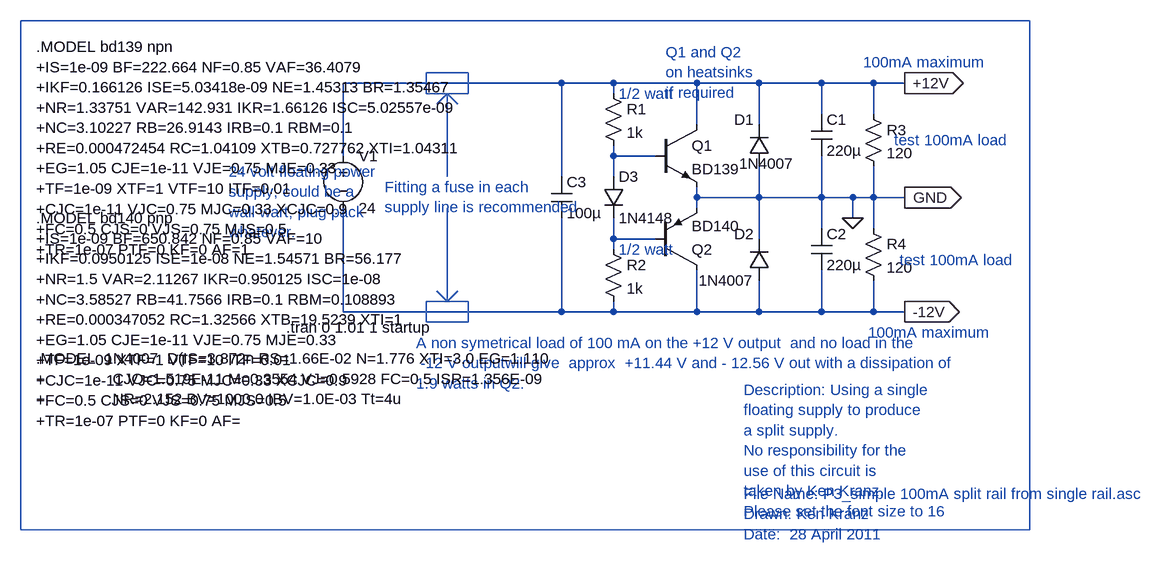
[diagram p0: schematic P3_simple100mAsplitrailfromsinglerail.asc]
P3_simple100mAsplitrailfromsinglerail.asc, the LTspice schematic file:
Version 4
SHEET 1 1304 932
WIRE 80 128 -256 128
WIRE 160 128 80 128
WIRE 288 128 160 128
WIRE 384 128 288 128
WIRE 480 128 384 128
WIRE 560 128 480 128
WIRE 608 128 560 128
WIRE 160 144 160 128
WIRE 480 176 480 128
WIRE 560 176 560 128
WIRE 288 192 288 128
WIRE 384 192 384 128
WIRE -256 240 -256 128
WIRE 160 240 160 224
WIRE 224 240 160 240
WIRE 80 272 80 128
WIRE 160 272 160 240
WIRE 288 304 288 288
WIRE 384 304 384 256
WIRE 384 304 288 304
WIRE 480 304 480 240
WIRE 480 304 384 304
WIRE 528 304 480 304
WIRE 560 304 560 256
WIRE 560 304 528 304
WIRE 608 304 560 304
WIRE 288 320 288 304
WIRE 528 336 528 304
WIRE 480 352 480 304
WIRE 560 352 560 304
WIRE 160 368 160 336
WIRE 224 368 160 368
WIRE 384 368 384 304
WIRE 160 384 160 368
WIRE -256 480 -256 320
WIRE 80 480 80 336
WIRE 80 480 -256 480
WIRE 160 480 160 464
WIRE 160 480 80 480
WIRE 288 480 288 416
WIRE 288 480 160 480
WIRE 384 480 384 432
WIRE 384 480 288 480
WIRE 480 480 480 416
WIRE 480 480 384 480
WIRE 560 480 560 432
WIRE 560 480 480 480
WIRE 608 480 560 480
FLAG 528 336 0
FLAG 608 304 GND
IOPIN 608 304 Out
FLAG 608 128 +12V
IOPIN 608 128 Out
FLAG 608 480 -12V
IOPIN 608 480 Out
SYMBOL voltage -256 224 R0
WINDOW 123 0 0 Left 2
WINDOW 39 0 0 Left 2
SYMATTR InstName V1
SYMATTR Value 24
SYMBOL res 144 128 R0
SYMATTR InstName R1
SYMATTR Value 1k
SYMBOL res 144 368 R0
SYMATTR InstName R2
SYMATTR Value 1k
SYMBOL cap 464 176 R0
SYMATTR InstName C1
SYMATTR Value 220µ
SYMBOL cap 464 352 R0
SYMATTR InstName C2
SYMATTR Value 220µ
SYMBOL cap 64 272 R0
SYMATTR InstName C3
SYMATTR Value 100µ
SYMBOL diode 400 256 R180
WINDOW 0 24 72 Left 2
WINDOW 3 -38 4 Left 2
SYMATTR InstName D1
SYMATTR Value 1N4007
SYMBOL diode 400 432 R180
WINDOW 0 24 72 Left 2
WINDOW 3 24 0 Left 2
SYMATTR InstName D2
SYMATTR Value 1N4007
SYMBOL diode 144 272 R0
SYMATTR InstName D3
SYMATTR Value 1N4148
SYMBOL res 544 160 R0
SYMATTR InstName R3
SYMATTR Value 120
SYMATTR SpiceLine pwr=2
SYMBOL res 544 336 R0
SYMATTR InstName R4
SYMATTR Value 120
SYMATTR SpiceLine pwr=2
SYMBOL npn 224 192 R0
SYMATTR InstName Q1
SYMATTR Value BD139
SYMATTR Prefix Q
SYMBOL pnp 224 416 M180
SYMATTR InstName Q2
SYMATTR Value BD140
TEXT -432 264 Left 2 ;24 volt floating power\nsupply, could be a \nwall wart, plug pack\nwhatever.
TEXT 544 96 Left 2 ;100mA maximum
TEXT 552 512 Left 2 ;100mA maximum
TEXT -192 288 Left 2 ;Fitting a fuse in each \nsupply line is recommended
TEXT -344 504 Left 2 !.tran 0 1.01 1 startup
TEXT 168 144 Left 2 ;1/2 watt
TEXT 168 384 Left 2 ;1/2 watt
TEXT 592 216 Left 2 ;test 100mA load
TEXT 600 400 Left 2 ;test 100mA load
TEXT 240 80 Left 2 ;Q1 and Q2\non heatsinks\nif required
TEXT -144 528 Left 2 ;A non symetrical load of 100 mA on the +12 V output  and no load in the\n -12 V outputwill give  approx  +11.44 V and - 12.56 V out with a dissipation of\n1.9 watts in Q2.
TEXT -728 72 Left 2 !.MODEL bd139 npn\n+IS=1e-09 BF=222.664 NF=0.85 VAF=36.4079\n+IKF=0.166126 ISE=5.03418e-09 NE=1.45313 BR=1.35467\n+NR=1.33751 VAR=142.931 IKR=1.66126 ISC=5.02557e-09\n+NC=3.10227 RB=26.9143 IRB=0.1 RBM=0.1\n+RE=0.000472454 RC=1.04109 XTB=0.727762 XTI=1.04311\n+EG=1.05 CJE=1e-11 VJE=0.75 MJE=0.33\n+TF=1e-09 XTF=1 VTF=10 ITF=0.01\n+CJC=1e-11 VJC=0.75 MJC=0.33 XCJC=0.9\n+FC=0.5 CJS=0 VJS=0.75 MJS=0.5\n+TR=1e-07 PTF=0 KF=0 AF=1
TEXT -728 336 Left 2 !.MODEL bd140 pnp\n+IS=1e-09 BF=650.842 NF=0.85 VAF=10\n+IKF=0.0950125 ISE=1e-08 NE=1.54571 BR=56.177\n+NR=1.5 VAR=2.11267 IKR=0.950125 ISC=1e-08\n+NC=3.58527 RB=41.7566 IRB=0.1 RBM=0.108893\n+RE=0.000347052 RC=1.32566 XTB=19.5239 XTI=1\n+EG=1.05 CJE=1e-11 VJE=0.75 MJE=0.33\n+TF=1e-09 XTF=1 VTF=10 ITF=0.01\n+CJC=1e-11 VJC=0.75 MJC=0.33 XCJC=0.9\n+FC=0.5 CJS=0 VJS=0.75 MJS=0.5\n+TR=1e-07 PTF=0 KF=0 AF=
TEXT -728 552 Left 2 !.MODEL  1N4007  D(IS=3.872n RS=1.66E-02 N=1.776 XTI=3.0 EG=1.110 \n+               CJO=1.519E-11 M=0.3554 VJ=0.5928 FC=0.5 ISR=1.356E-09\n+               NR=2.152 BV=1000.0 IBV=1.0E-03 Tt=4u
TEXT 360 600 Left 2 ;Description: Using a single\nfloating supply to produce\na split supply.\nNo responsibility for the\nuse of this circuit is \ntaken by Ken Kranz.\nPlease set the font size to 16
TEXT 360 760 Left 2 ;File Name: P3_simple 100mA split rail from single rail.asc\nDrawn: Ken Kranz\nDate:  28 April 2011
LINE Normal -96 144 -96 272
LINE Normal -96 144 -96 144
LINE Normal -80 160 -96 144
LINE Normal -96 144 -112 160
LINE Normal -96 464 -96 320
LINE Normal -80 448 -96 464
LINE Normal -112 448 -96 464
RECTANGLE Normal -64 144 -128 112
RECTANGLE Normal -64 496 -128 464
RECTANGLE Normal 800 816 -752 32

The netlist it stands for:
* P3_simple100mAsplitrailfromsinglerail.asc
V1 +12V -12V 24
R1 +12V N001 1k
R2 N002 -12V 1k
C1 +12V 0 220µ
C2 0 -12V 220µ
C3 +12V -12V 100µ
D1 0 +12V 1N4007
D2 -12V 0 1N4007
D3 N001 N002 1N4148
R3 +12V 0 120 pwr=2
R4 0 -12V 120 pwr=2
Q1 +12V N001 0 0 BD139
Q2 -12V N002 0 0 BD140
.model D D
.lib standard.dio
.model NPN NPN
.model PNP PNP
.lib standard.bjt
* 24 volt floating power
* supply, could be a
* wall wart, plug pack
* whatever.
* 100mA maximum
* 100mA maximum
* Fitting a fuse in each
* supply line is recommended
.tran 0 1.01 1 startup
* 1/2 watt
* 1/2 watt
* test 100mA load
* test 100mA load
* Q1 and Q2
* on heatsinks
* if required
* A non symetrical load of 100 mA on the +12 V output  and no load in the
*  -12 V outputwill give  approx  +11.44 V and - 12.56 V out with a dissipation of
* 1.9 watts in Q2.
.MODEL bd139 npn
+IS=1e-09 BF=222.664 NF=0.85 VAF=36.4079
+IKF=0.166126 ISE=5.03418e-09 NE=1.45313 BR=1.35467
+NR=1.33751 VAR=142.931 IKR=1.66126 ISC=5.02557e-09
+NC=3.10227 RB=26.9143 IRB=0.1 RBM=0.1
+RE=0.000472454 RC=1.04109 XTB=0.727762 XTI=1.04311
+EG=1.05 CJE=1e-11 VJE=0.75 MJE=0.33
+TF=1e-09 XTF=1 VTF=10 ITF=0.01
+CJC=1e-11 VJC=0.75 MJC=0.33 XCJC=0.9
+FC=0.5 CJS=0 VJS=0.75 MJS=0.5
+TR=1e-07 PTF=0 KF=0 AF=1
.MODEL bd140 pnp
+IS=1e-09 BF=650.842 NF=0.85 VAF=10
+IKF=0.0950125 ISE=1e-08 NE=1.54571 BR=56.177
+NR=1.5 VAR=2.11267 IKR=0.950125 ISC=1e-08
+NC=3.58527 RB=41.7566 IRB=0.1 RBM=0.108893
+RE=0.000347052 RC=1.32566 XTB=19.5239 XTI=1
+EG=1.05 CJE=1e-11 VJE=0.75 MJE=0.33
+TF=1e-09 XTF=1 VTF=10 ITF=0.01
+CJC=1e-11 VJC=0.75 MJC=0.33 XCJC=0.9
+FC=0.5 CJS=0 VJS=0.75 MJS=0.5
+TR=1e-07 PTF=0 KF=0 AF=
.MODEL  1N4007  D(IS=3.872n RS=1.66E-02 N=1.776 XTI=3.0 EG=1.110
+               CJO=1.519E-11 M=0.3554 VJ=0.5928 FC=0.5 ISR=1.356E-09
+               NR=2.152 BV=1000.0 IBV=1.0E-03 Tt=4u
* Description: Using a single
* floating supply to produce
* a split supply.
* No responsibility for the
* use of this circuit is
* taken by Ken Kranz.
* Please set the font size to 16
* File Name: P3_simple 100mA split rail from single rail.asc
* Drawn: Ken Kranz
* Date:  28 April 2011
.backanno
.end